# Altium schematic sheet SODIMM.SchDoc
size 393 x 281 mm
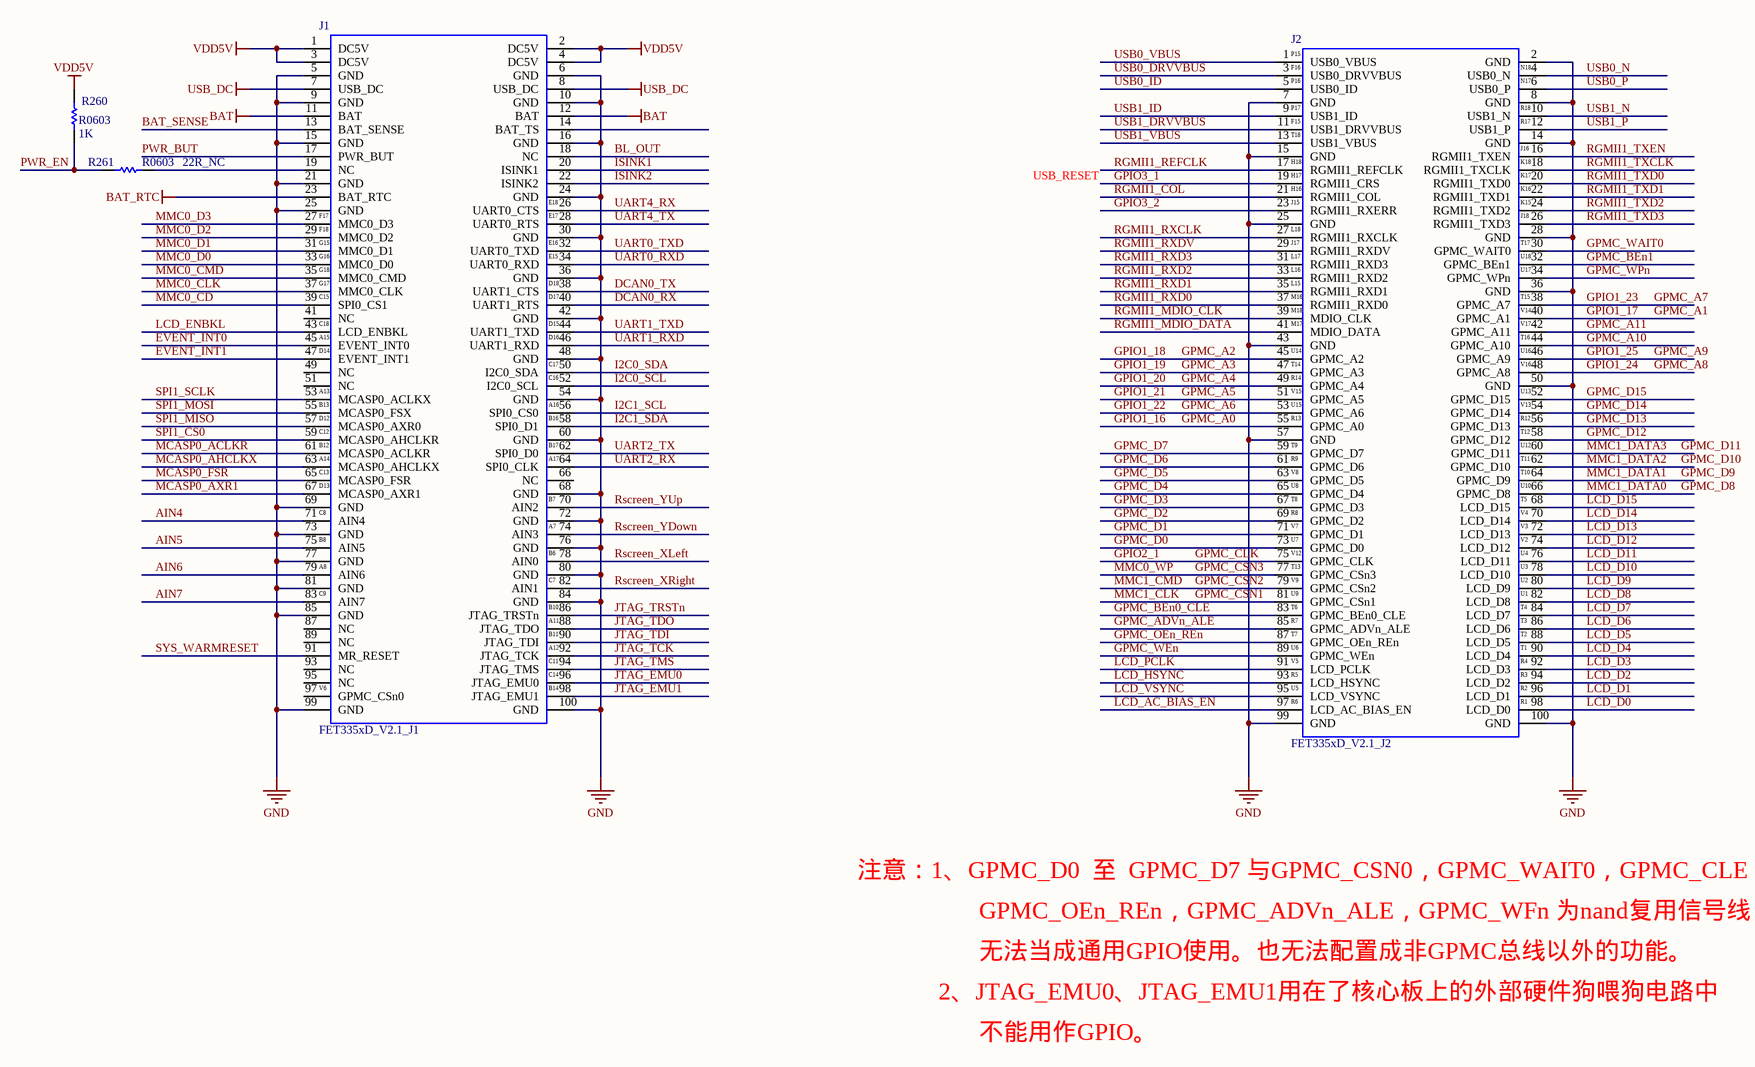
[diagram p0: SODIMM.SchDoc]

## Parts
J1  FET335xD_V2.1_J1  [1.27MM SMT CONNECT PIN]
J2  FET335xD_V2.1_J2  [1.27MM SMT CONNECT PIN]
R260  R0603  value 1K  [R0603_M1608]
R261  R0603  value 22R_NC  [R0603_M1608]

## Nets
BAT: J1.11(BAT) J1.12(BAT)
BAT_RTC: J1.23(BAT_RTC)
GND: J1.5(GND) J1.6(GND) J1.9(GND) J1.10(GND) J1.15(GND) J1.16(GND) J1.21(GND) J1.24(GND) J1.25(GND) J1.30(GND) J1.36(GND) J1.42(GND) J1.48(GND) J1.54(GND) J1.60(GND) J1.68(GND) J1.69(GND) J1.72(GND) J1.73(GND) J1.76(GND) J1.77(GND) J1.80(GND) J1.81(GND) J1.84(GND) J1.85(GND) J1.99(GND) J1.100(GND) J2.2(GND) J2.7(GND) J2.8(GND) J2.14(GND) J2.15(GND) J2.25(GND) J2.28(GND) J2.36(GND) J2.43(GND) J2.50(GND) J2.57(GND) J2.99(GND) J2.100(GND)
USB_DC: J1.7(USB_DC) J1.8(USB_DC)
VDD5V: J1.1(DC5V) J1.2(DC5V) J1.3(DC5V) J1.4(DC5V) R260.1
AIN4: J1.71(AIN4)
AIN5: J1.75(AIN5)
AIN6: J1.79(AIN6)
AIN7: J1.83(AIN7)
BAT_SENSE: J1.13(BAT_SENSE)
BL_OUT: J1.18(NC)
DCAN0_RX: J1.40(UART1_RTS)
DCAN0_TX: J1.38(UART1_CTS)
EVENT_INT0: J1.45(EVENT_INT0)
EVENT_INT1: J1.47(EVENT_INT1)
GPIO1_16: J2.55(GPMC_A0)  [also labelled GPMC_A0]
GPIO1_17: J2.40(GPMC_A1)  [also labelled GPMC_A1]
GPIO1_18: J2.45(GPMC_A2)  [also labelled GPMC_A2]
GPIO1_19: J2.47(GPMC_A3)  [also labelled GPMC_A3]
GPIO1_20: J2.49(GPMC_A4)  [also labelled GPMC_A4]
GPIO1_21: J2.51(GPMC_A5)  [also labelled GPMC_A5]
GPIO1_22: J2.53(GPMC_A6)  [also labelled GPMC_A6]
GPIO1_23: J2.38(GPMC_A7)  [also labelled GPMC_A7]
GPIO1_24: J2.48(GPMC_A8)  [also labelled GPMC_A8]
GPIO1_25: J2.46(GPMC_A9)  [also labelled GPMC_A9]
GPIO2_1: J2.75(GPMC_CLK)  [also labelled GPMC_CLK]
GPIO3_1: J2.19(RGMII1_CRS)
GPIO3_2: J2.23(RGMII1_RXERR)
GPMC_A10: J2.44(GPMC_A10)
GPMC_A11: J2.42(GPMC_A11)
GPMC_ADVn_ALE: J2.85(GPMC_ADVn_ALE)
GPMC_BEn0_CLE: J2.83(GPMC_BEn0_CLE)
GPMC_BEn1: J2.32(GPMC_BEn1)
GPMC_CSN1: J2.81(GPMC_CSn1)  [also labelled MMC1_CLK]
GPMC_CSN2: J2.79(GPMC_CSn2)  [also labelled MMC1_CMD]
GPMC_CSN3: J2.77(GPMC_CSn3)  [also labelled MMC0_WP]
GPMC_D0: J2.73(GPMC_D0)
GPMC_D1: J2.71(GPMC_D1)
GPMC_D2: J2.69(GPMC_D2)
GPMC_D3: J2.67(GPMC_D3)
GPMC_D4: J2.65(GPMC_D4)
GPMC_D5: J2.63(GPMC_D5)
GPMC_D6: J2.61(GPMC_D6)
GPMC_D7: J2.59(GPMC_D7)
GPMC_D8: J2.66(GPMC_D8)  [also labelled MMC1_DATA0]
GPMC_D9: J2.64(GPMC_D9)  [also labelled MMC1_DATA1]
GPMC_D10: J2.62(GPMC_D10)  [also labelled MMC1_DATA2]
GPMC_D11: J2.60(GPMC_D11)  [also labelled MMC1_DATA3]
GPMC_D12: J2.58(GPMC_D12)
GPMC_D13: J2.56(GPMC_D13)
GPMC_D14: J2.54(GPMC_D14)
GPMC_D15: J2.52(GPMC_D15)
GPMC_OEn_REn: J2.87(GPMC_OEn_REn)
GPMC_WAIT0: J2.30(GPMC_WAIT0)
GPMC_WEn: J2.89(GPMC_WEn)
GPMC_WPn: J2.34(GPMC_WPn)
I2C0_SCL: J1.52(I2C0_SCL)
I2C0_SDA: J1.50(I2C0_SDA)
I2C1_SCL: J1.56(SPI0_CS0)
I2C1_SDA: J1.58(SPI0_D1)
ISINK1: J1.20(ISINK1)
ISINK2: J1.22(ISINK2)
JTAG_EMU0: J1.96(JTAG_EMU0)
JTAG_EMU1: J1.98(JTAG_EMU1)
JTAG_TCK: J1.92(JTAG_TCK)
JTAG_TDI: J1.90(JTAG_TDI)
JTAG_TDO: J1.88(JTAG_TDO)
JTAG_TMS: J1.94(JTAG_TMS)
JTAG_TRSTn: J1.86(JTAG_TRSTn)
LCD_AC_BIAS_EN: J2.97(LCD_AC_BIAS_EN)
LCD_D0: J2.98(LCD_D0)
LCD_D1: J2.96(LCD_D1)
LCD_D2: J2.94(LCD_D2)
LCD_D3: J2.92(LCD_D3)
LCD_D4: J2.90(LCD_D4)
LCD_D5: J2.88(LCD_D5)
LCD_D6: J2.86(LCD_D6)
LCD_D7: J2.84(LCD_D7)
LCD_D8: J2.82(LCD_D8)
LCD_D9: J2.80(LCD_D9)
LCD_D10: J2.78(LCD_D10)
LCD_D11: J2.76(LCD_D11)
LCD_D12: J2.74(LCD_D12)
LCD_D13: J2.72(LCD_D13)
LCD_D14: J2.70(LCD_D14)
LCD_D15: J2.68(LCD_D15)
LCD_ENBKL: J1.43(LCD_ENBKL)
LCD_HSYNC: J2.93(LCD_HSYNC)
LCD_PCLK: J2.91(LCD_PCLK)
LCD_VSYNC: J2.95(LCD_VSYNC)
MCASP0_ACLKR: J1.61(MCASP0_ACLKR)
MCASP0_AHCLKX: J1.63(MCASP0_AHCLKX)
MCASP0_AXR1: J1.67(MCASP0_AXR1)
MCASP0_FSR: J1.65(MCASP0_FSR)
MMC0_CD: J1.39(SPI0_CS1)
MMC0_CLK: J1.37(MMC0_CLK)
MMC0_CMD: J1.35(MMC0_CMD)
MMC0_D0: J1.33(MMC0_D0)
MMC0_D1: J1.31(MMC0_D1)
MMC0_D2: J1.29(MMC0_D2)
MMC0_D3: J1.27(MMC0_D3)
PWR_BUT: J1.17(PWR_BUT)
PWR_EN: R260.2 R261.1
RGMII1_COL: J2.21(RGMII1_COL)
RGMII1_MDIO_CLK: J2.39(MDIO_CLK)
RGMII1_MDIO_DATA: J2.41(MDIO_DATA)
RGMII1_REFCLK: J2.17(RGMII1_REFCLK)
RGMII1_RXCLK: J2.27(RGMII1_RXCLK)
RGMII1_RXD0: J2.37(RGMII1_RXD0)
RGMII1_RXD1: J2.35(RGMII1_RXD1)
RGMII1_RXD2: J2.33(RGMII1_RXD2)
RGMII1_RXD3: J2.31(RGMII1_RXD3)
RGMII1_RXDV: J2.29(RGMII1_RXDV)
RGMII1_TXCLK: J2.18(RGMII1_TXCLK)
RGMII1_TXD0: J2.20(RGMII1_TXD0)
RGMII1_TXD1: J2.22(RGMII1_TXD1)
RGMII1_TXD2: J2.24(RGMII1_TXD2)
RGMII1_TXD3: J2.26(RGMII1_TXD3)
RGMII1_TXEN: J2.16(RGMII1_TXEN)
Rscreen_XLeft: J1.78(AIN0)
Rscreen_XRight: J1.82(AIN1)
Rscreen_YDown: J1.74(AIN3)
Rscreen_YUp: J1.70(AIN2)
SPI1_CS0: J1.59(MCASP0_AHCLKR)
SPI1_MISO: J1.57(MCASP0_AXR0)
SPI1_MOSI: J1.55(MCASP0_FSX)
SPI1_SCLK: J1.53(MCASP0_ACLKX)
SYS_WARMRESET: J1.91(MR_RESET)
UART0_RXD: J1.34(UART0_RXD)
UART0_TXD: J1.32(UART0_TXD)
UART1_RXD: J1.46(UART1_RXD)
UART1_TXD: J1.44(UART1_TXD)
UART2_RX: J1.64(SPI0_CLK)
UART2_TX: J1.62(SPI0_D0)
UART4_RX: J1.26(UART0_CTS)
UART4_TX: J1.28(UART0_RTS)
USB0_DRVVBUS: J2.3(USB0_DRVVBUS)
USB0_ID: J2.5(USB0_ID)
USB0_N: J2.4(USB0_N)
USB0_P: J2.6(USB0_P)
USB0_VBUS: J2.1(USB0_VBUS)
USB1_DRVVBUS: J2.11(USB1_DRVVBUS)
USB1_ID: J2.9(USB1_ID)
USB1_N: J2.10(USB1_N)
USB1_P: J2.12(USB1_P)
USB1_VBUS: J2.13(USB1_VBUS)
NetJ1_19: J1.19(NC) R261.2

Not connected (* = marked no-connect by the designer): J1 14(BAT_TS) 41(NC) 49(NC) 51(NC) 66(NC) 87(NC) 89(NC) 93(NC) 95(NC) 97(GPMC_CSn0)

## Notes on the sheet
- USB_RESET
- 注意：1、GPMC_D0  至  GPMC_D7 与GPMC_CSN0，GPMC_WAIT0，GPMC_CLE
- GPMC_OEn_REn，GPMC_ADVn_ALE，GPMC_WFn 为nand复用信号线
- 无法当成通用GPIO使用。也无法配置成非GPMC总线以外的功能。
- 2、JTAG_EMU0、JTAG_EMU1用在了核心板上的外部硬件狗喂狗电路中
- 不能用作GPIO。
- 设计
- 标准化
- 审核
- 批  准
- 版本
- 工艺
- 日  期
- 第    页
- 共    页
- (in symbol FET335xD_V2.1_J1) E18; F17; E17; F18; G15; E16; G16; E15; G18; G17; D18; C15; D17; C18; D15; A15; D16; D14; C17; C16; A13; B13; A16; D12; B16; C12; B12; B17; A14; A17; C13; D13; B7; C8; A7; B8; B6; A8; C7; C9; B10; A11; B11; A12; C11; C14; V6; B14
- (in symbol FET335xD_V2.1_J2) P15; F16; N18; P16; N17; P17; R18; F15; R17; T18; J16; H18; K18; H17; K17; H16; K16; J15; K15; J18; L18; J17; T17; L17; U18; L16; U17; L15; M16; T15; M18; V14; M17; V17; T16; U14; U16; T14; V16; R14; V15; U13; U15; V13; R13; R12; T12; T9; U12; R9; T11; V8; T10; U8; U10; T8; T5; R8; V4; V7; V3; U7; V2; V12; U4; T13; U3; V9; U2; U9; U1; T6; T4; R7; T3; T7; T2; U6; T1; V5; R4; R5; R3; U5; R2; R6; R1

## Library data of the parts
R260 R261 = Res1: Resistor; Published: 8-Jun-2000; LatestRevisionDate: 17-Jul-2002; LatestRevisionNote: Re-released for DXP Platform.; PackageReference: AXIAL-0.3; Publisher: Altium Limited
J1 = FET335xD_V2.1_J1: Value: FET335xD_V2.1_J1
J2 = FET335xD_V2.1_J2: Value: FET335xD_V2.1_J2